# Altium schematic sheet CyberDeck.SchDoc
size A4; DocumentNumber: 11; SheetNumber: 11; SheetTotal: 12; RelSerie: X
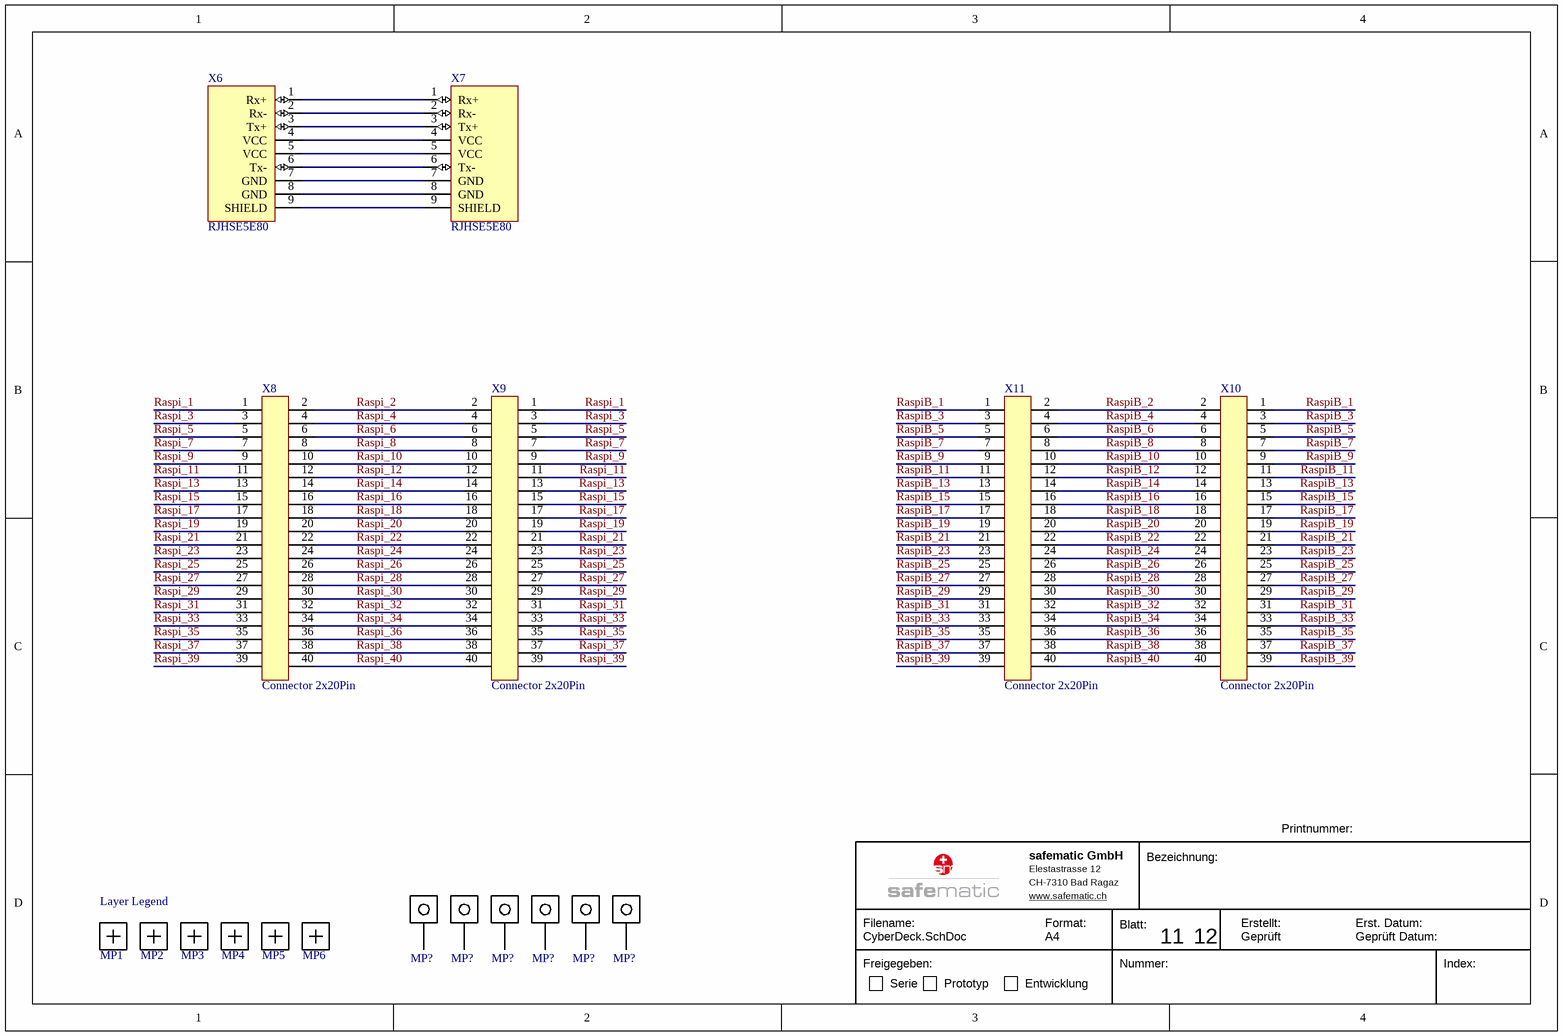
[diagram p0: CyberDeck.SchDoc]

## Parts
(Parts that share a designator on the sheet are numbered #1, #2 ... from top to bottom, then left to right.)
?  MP_Legend  [PCB LEGEND]  (value not drawn)
MP1  Fiducial  [REF - smaller]  (value not drawn)  (no BOM)
MP2  Fiducial  [REF - smaller]  (value not drawn)  (no BOM)
MP3  Fiducial  [REF - smaller]  (value not drawn)  (no BOM)
MP4  Fiducial  [REF - smaller]  (value not drawn)  (no BOM)
MP5  Fiducial  [REF - smaller]  (value not drawn)  (no BOM)
MP6  Fiducial  [REF - smaller]  (value not drawn)  (no BOM)
MP?#1  Mounting Hole  [M3x08S - Erdung]  (value not drawn)  (no BOM)
MP?#2  Mounting Hole  [M3x08S - Erdung]  (value not drawn)  (no BOM)
MP?#3  Mounting Hole  [M3x08S - Erdung]  (value not drawn)  (no BOM)
MP?#4  Mounting Hole  [M3x08S - Erdung]  (value not drawn)  (no BOM)
MP?#5  Mounting Hole  [M3x08S - Erdung]  (value not drawn)  (no BOM)
MP?#6  Mounting Hole  [M3x08S - Erdung]  (value not drawn)  (no BOM)
X6  RJHSE5E80  [RJ45]
X7  RJHSE5E80  [RJ45]
X8  Connector 2x20Pin  [Pin Header 2x20 TH Pitch 2.54mm - sh]
X9  Connector 2x20Pin  [Pin Header 2x20 TH Pitch 2.54mm - sh]
X10  Connector 2x20Pin  [Pin Header 2x20 TH Pitch 2.54mm F]
X11  Connector 2x20Pin  [Pin Header 2x20 TH Pitch 2.54mm - sh]

## Nets
Raspi_1: X8.1 X9.1
Raspi_2: X8.2 X9.2
Raspi_3: X8.3 X9.3
Raspi_4: X8.4 X9.4
Raspi_5: X8.5 X9.5
Raspi_6: X8.6 X9.6
Raspi_7: X8.7 X9.7
Raspi_8: X8.8 X9.8
Raspi_9: X8.9 X9.9
Raspi_10: X8.10 X9.10
Raspi_11: X8.11 X9.11
Raspi_12: X8.12 X9.12
Raspi_13: X8.13 X9.13
Raspi_14: X8.14 X9.14
Raspi_15: X8.15 X9.15
Raspi_16: X8.16 X9.16
Raspi_17: X8.17 X9.17
Raspi_18: X8.18 X9.18
Raspi_19: X8.19 X9.19
Raspi_20: X8.20 X9.20
Raspi_21: X8.21 X9.21
Raspi_22: X8.22 X9.22
Raspi_23: X8.23 X9.23
Raspi_24: X8.24 X9.24
Raspi_25: X8.25 X9.25
Raspi_26: X8.26 X9.26
Raspi_27: X8.27 X9.27
Raspi_28: X8.28 X9.28
Raspi_29: X8.29 X9.29
Raspi_30: X8.30 X9.30
Raspi_31: X8.31 X9.31
Raspi_32: X8.32 X9.32
Raspi_33: X8.33 X9.33
Raspi_34: X8.34 X9.34
Raspi_35: X8.35 X9.35
Raspi_36: X8.36 X9.36
Raspi_37: X8.37 X9.37
Raspi_38: X8.38 X9.38
Raspi_39: X8.39 X9.39
Raspi_40: X8.40 X9.40
RaspiB_1: X10.1 X11.1
RaspiB_2: X10.2 X11.2
RaspiB_3: X10.3 X11.3
RaspiB_4: X10.4 X11.4
RaspiB_5: X10.5 X11.5
RaspiB_6: X10.6 X11.6
RaspiB_7: X10.7 X11.7
RaspiB_8: X10.8 X11.8
RaspiB_9: X10.9 X11.9
RaspiB_10: X10.10 X11.10
RaspiB_11: X10.11 X11.11
RaspiB_12: X10.12 X11.12
RaspiB_13: X10.13 X11.13
RaspiB_14: X10.14 X11.14
RaspiB_15: X10.15 X11.15
RaspiB_16: X10.16 X11.16
RaspiB_17: X10.17 X11.17
RaspiB_18: X10.18 X11.18
RaspiB_19: X10.19 X11.19
RaspiB_20: X10.20 X11.20
RaspiB_21: X10.21 X11.21
RaspiB_22: X10.22 X11.22
RaspiB_23: X10.23 X11.23
RaspiB_24: X10.24 X11.24
RaspiB_25: X10.25 X11.25
RaspiB_26: X10.26 X11.26
RaspiB_27: X10.27 X11.27
RaspiB_28: X10.28 X11.28
RaspiB_29: X10.29 X11.29
RaspiB_30: X10.30 X11.30
RaspiB_31: X10.31 X11.31
RaspiB_32: X10.32 X11.32
RaspiB_33: X10.33 X11.33
RaspiB_34: X10.34 X11.34
RaspiB_35: X10.35 X11.35
RaspiB_36: X10.36 X11.36
RaspiB_37: X10.37 X11.37
RaspiB_38: X10.38 X11.38
RaspiB_39: X10.39 X11.39
RaspiB_40: X10.40 X11.40
NetX6_1: X6.1(Rx+) X7.1(Rx+)
NetX6_2: X6.2(Rx-) X7.2(Rx-)
NetX6_3: X6.3(Tx+) X7.3(Tx+)
NetX6_4: X6.4(VCC) X7.4(VCC)
NetX6_5: X6.5(VCC) X7.5(VCC)
NetX6_6: X6.6(Tx-) X7.6(Tx-)
NetX6_7: X6.7(GND) X7.7(GND)
NetX6_8: X6.8(GND) X7.8(GND)
NetX6_9: X6.9(SHIELD) X7.9(SHIELD)

Not connected (* = marked no-connect by the designer): MP?#1 1; MP?#2 1; MP?#3 1; MP?#4 1; MP?#5 1; MP?#6 1

## Notes on the sheet
- safematic GmbH
- Bezeichnung:
- Printnummer:
- Filename:
- Elestastrasse 12
- CH-7310 Bad Ragaz
- www.safematic.ch <http://www.safematic.ch>
- Format:
- Blatt:
- Erstellt:
- Erst. Datum:
- Freigegeben:
- Serie
- Prototyp
- Entwicklung
- A4
- Nummer:
- Geprüft
- Geprüft Datum:
- Index:
- (in symbol MP_Legend) Layer Legend

## Library data of the parts
? = MP_Legend: Layer legend
MP1-MP6 = MP_Fiducial
MP?#1-MP?#6 = MP_Mounting Hole connected: Different Mounting holes; Manufacturer: Wurth Electronics; Manufacturer Part Number: 9774080482R; Supplier 1: Farnell; Supplier Part Number 1: 2847858; Stock 1: 49; Pricing 1: 1=1.59, 50=1.51, 100=1.44 (EUR)
X6 X7 = X_RJHSE5E80: Modular Connectors / Ethernet Connectors High Speed RJ w/no LED's or Shield; Manufacturer 1: Amphenol Commercial; Voltage Rating: 125V; Manufacturer Part Number 1: RJHSE5E80; Termination: Solder; ComponentLink1URL: http://www.mouser.com/ds/2/18/Amphenol_RJHSE_BRO-311217.pdf; ComponentLink1Description: http://www.mouser.com/ds/2/18/Amphenol_RJHSE_BRO-311217.pdf; ComponentLink2URL: https://www.amphenolcanada.com/ProductSearch/pdf/RJHSE_BRO.pdf; ComponentLink2Description: https://www.amphenolcanada.com/ProductSearch/pdf/RJHSE_BRO.pdf; Supplier 1: Digi-Key; Supplier Part Number 1: RJHSE5E80-ND; ComponentLink3URL: https://datasheet.ciiva.com/16408/eng-cd-6368150-b1-16408714.pdf; ComponentLink3Description: https://datasheet.ciiva.com/16408/eng-cd-6368150-b1-16408714.pdf; ComponentLink4URL: https://datasheet.ciiva.com/30494/0900766b8121d3d0-30494389.pdf; ComponentLink4Description: https://datasheet.ciiva.com/30494/0900766b8121d3d0-30494389.pdf; ComponentLink5URL: https://datasheet.ciiva.com/30086/63681501-30086239.pdf; ComponentLink5Description: https://datasheet.ciiva.com/30086/63681501-30086239.pdf; ComponentLink7URL: https://datasheet.ciiva.com/685/eng-cd-6368150-c1-685799.pdf; ComponentLink7Description: https://datasheet.ciiva.com/685/eng-cd-6368150-c1-685799.pdf
X8-X11 = X_Connector 2x20Pin: Generic connector 2x20 Pin